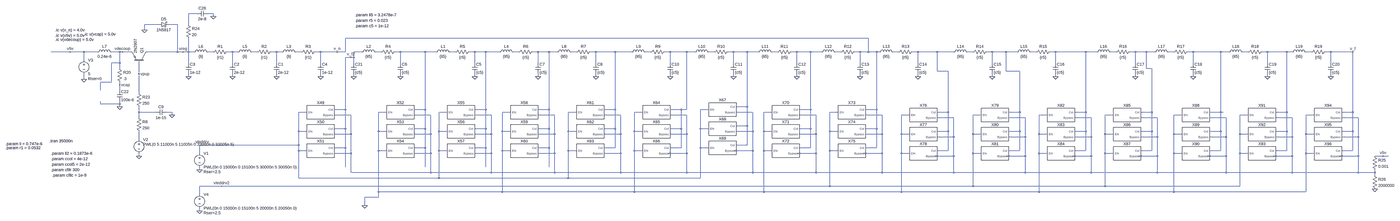
[diagram p0: schematic ModelAccurateColumn2.asc, whole sheet]
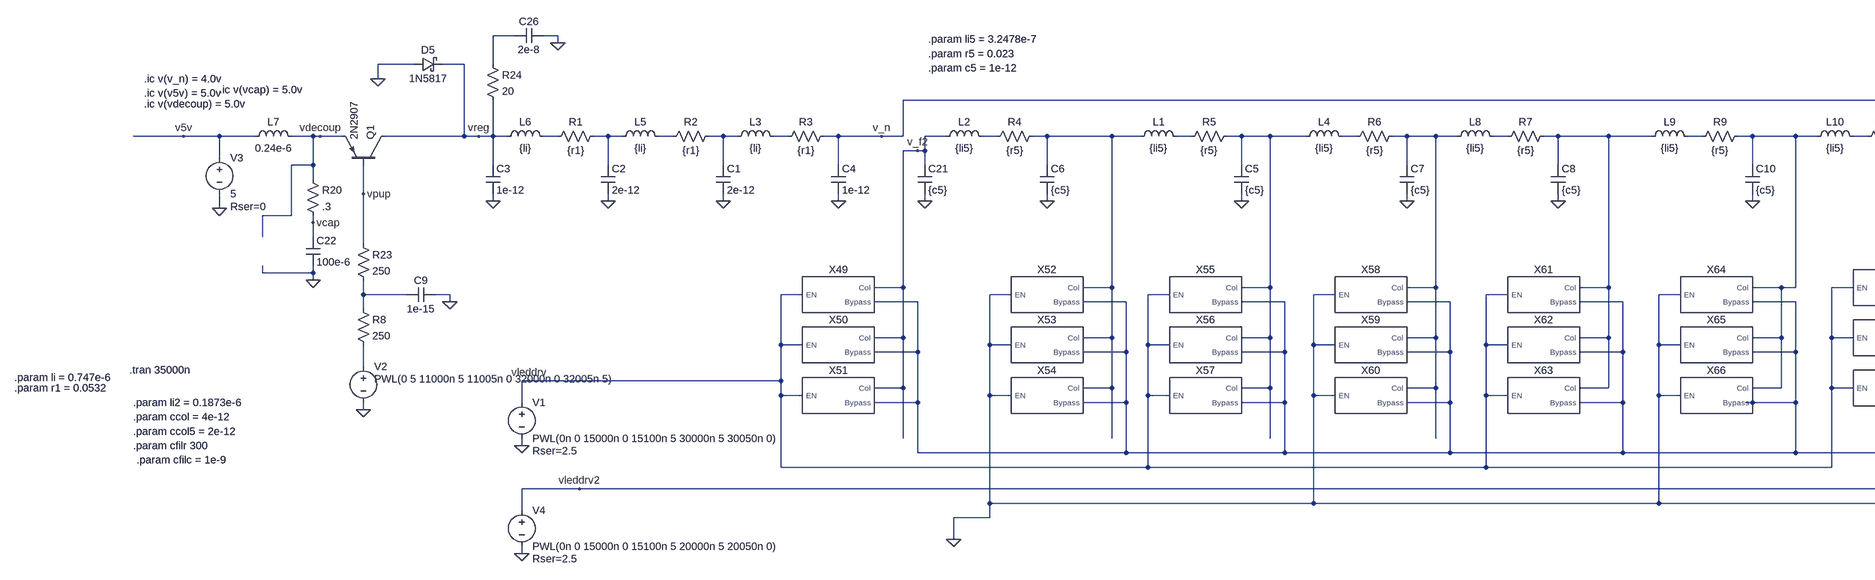
[diagram p1: schematic ModelAccurateColumn2.asc, part, row 1 of 1, column 1 of 2]
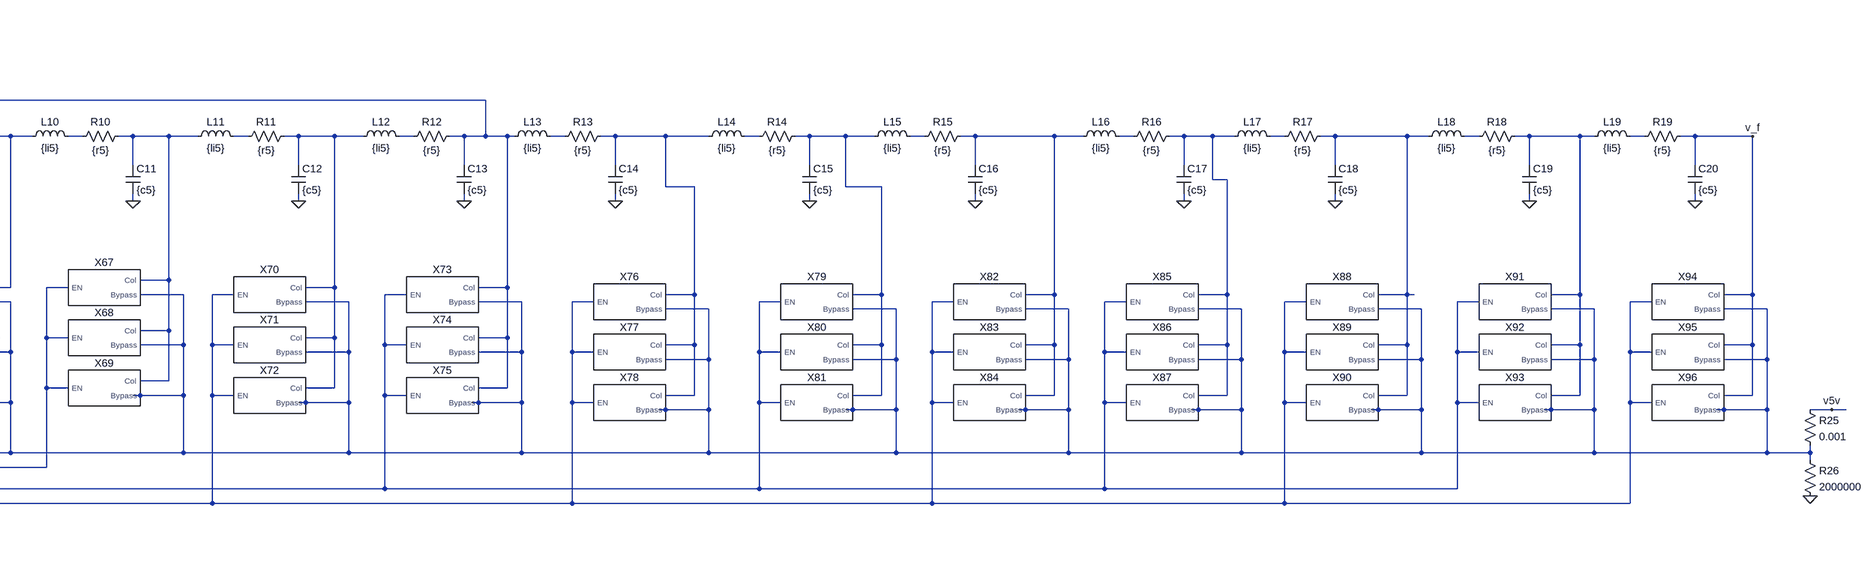
[diagram p2: schematic ModelAccurateColumn2.asc, part, row 1 of 1, column 2 of 2]
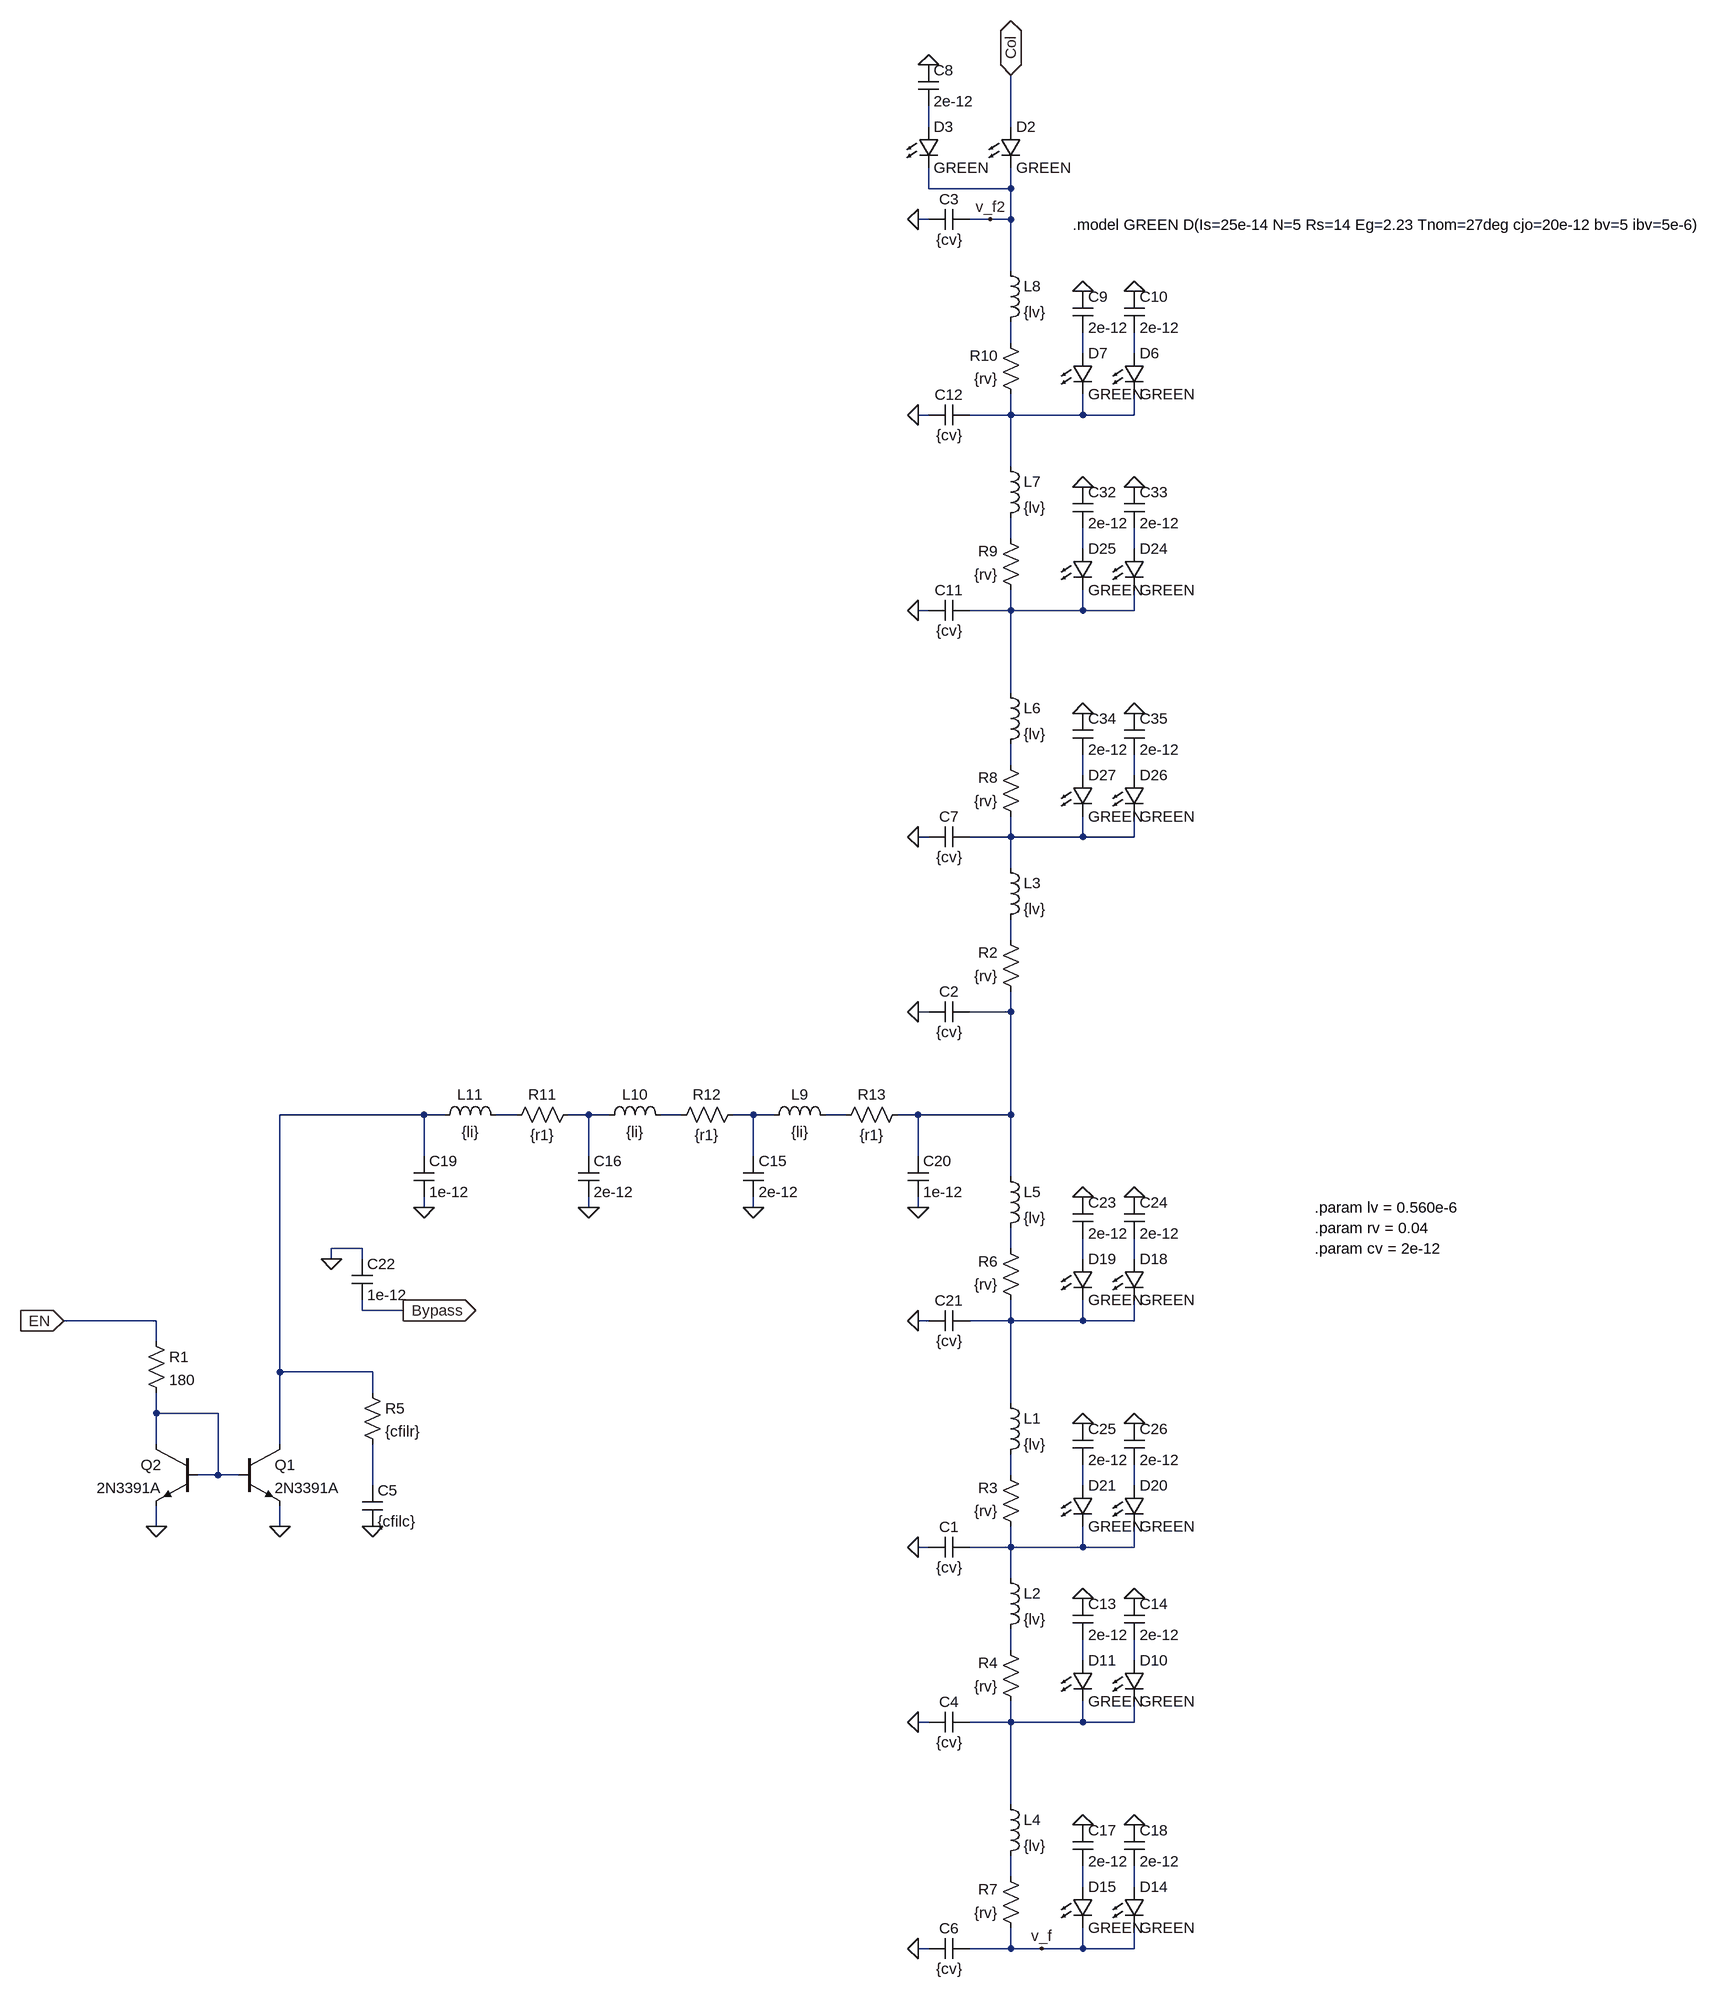
[diagram p3: sub-circuit coldrv2.asc]
ModelAccurateColumn2.asc, the LTspice schematic file:
Version 4
SHEET 1 7096 2164
WIRE 16 -112 -32 -112
WIRE 112 -112 80 -112
WIRE 112 -96 112 -112
WIRE -208 -48 -288 -48
WIRE -96 -48 -144 -48
WIRE -32 -48 -32 -112
WIRE -288 -16 -288 -48
WIRE 3920 32 880 32
WIRE -720 112 -832 112
WIRE -640 112 -720 112
WIRE -560 112 -640 112
WIRE -432 112 -480 112
WIRE -416 112 -432 112
WIRE -368 112 -416 112
WIRE -96 112 -96 -48
WIRE -96 112 -272 112
WIRE -64 112 -96 112
WIRE -32 112 -32 32
WIRE -32 112 -64 112
WIRE 0 112 -32 112
WIRE 112 112 80 112
WIRE 224 112 192 112
WIRE 256 112 224 112
WIRE 368 112 336 112
WIRE 480 112 448 112
WIRE 512 112 480 112
WIRE 624 112 592 112
WIRE 736 112 704 112
WIRE 832 112 736 112
WIRE 880 112 880 32
WIRE 880 112 832 112
WIRE 976 112 928 112
WIRE 1088 112 1056 112
WIRE 1200 112 1168 112
WIRE 1344 112 1200 112
WIRE 1408 112 1344 112
WIRE 1520 112 1488 112
WIRE 1632 112 1600 112
WIRE 1696 112 1632 112
WIRE 1776 112 1696 112
WIRE 1888 112 1856 112
WIRE 2000 112 1968 112
WIRE 2064 112 2000 112
WIRE 2112 112 2064 112
WIRE 2224 112 2192 112
WIRE 2336 112 2304 112
WIRE 2448 112 2336 112
WIRE 2544 112 2448 112
WIRE 2656 112 2624 112
WIRE 2768 112 2736 112
WIRE 2864 112 2768 112
WIRE 2912 112 2864 112
WIRE 3024 112 2992 112
WIRE 3136 112 3104 112
WIRE 3216 112 3136 112
WIRE 3280 112 3216 112
WIRE 3392 112 3360 112
WIRE 3504 112 3472 112
WIRE 3584 112 3504 112
WIRE 3648 112 3584 112
WIRE 3760 112 3728 112
WIRE 3872 112 3840 112
WIRE 3920 112 3920 32
WIRE 3920 112 3872 112
WIRE 3968 112 3920 112
WIRE 3984 112 3968 112
WIRE 4096 112 4064 112
WIRE 4208 112 4176 112
WIRE 4320 112 4208 112
WIRE 4416 112 4320 112
WIRE 4528 112 4496 112
WIRE 4640 112 4608 112
WIRE 4720 112 4640 112
WIRE 4784 112 4720 112
WIRE 4896 112 4864 112
WIRE 5008 112 4976 112
WIRE 5184 112 5008 112
WIRE 5248 112 5184 112
WIRE 5360 112 5328 112
WIRE 5472 112 5440 112
WIRE 5536 112 5472 112
WIRE 5584 112 5536 112
WIRE 5696 112 5664 112
WIRE 5808 112 5776 112
WIRE 5968 112 5808 112
WIRE 6016 112 5968 112
WIRE 6128 112 6096 112
WIRE 6240 112 6208 112
WIRE 6352 112 6240 112
WIRE 6384 112 6352 112
WIRE 6496 112 6464 112
WIRE 6608 112 6576 112
WIRE 6736 112 6608 112
WIRE 912 144 880 144
WIRE 928 144 928 112
WIRE 928 144 912 144
WIRE -640 160 -640 112
WIRE -432 176 -432 112
WIRE -432 176 -480 176
WIRE -32 176 -32 112
WIRE 224 176 224 112
WIRE 480 176 480 112
WIRE 736 176 736 112
WIRE 928 176 928 144
WIRE 1200 176 1200 112
WIRE 1632 176 1632 112
WIRE 2000 176 2000 112
WIRE 2336 176 2336 112
WIRE 2768 176 2768 112
WIRE 3136 176 3136 112
WIRE 3504 176 3504 112
WIRE 3872 176 3872 112
WIRE 4208 176 4208 112
WIRE 4640 176 4640 112
WIRE 5008 176 5008 112
WIRE 5472 176 5472 112
WIRE 5808 176 5808 112
WIRE 6240 176 6240 112
WIRE 6608 176 6608 112
WIRE -432 208 -432 176
WIRE 5536 208 5536 112
WIRE 5568 208 5536 208
WIRE 4320 224 4320 112
WIRE 4384 224 4320 224
WIRE 4720 224 4720 112
WIRE 4800 224 4720 224
WIRE -320 240 -320 176
WIRE -32 256 -32 240
WIRE 224 256 224 240
WIRE 480 256 480 240
WIRE 736 256 736 240
WIRE 928 256 928 240
WIRE 1200 256 1200 240
WIRE 1632 256 1632 240
WIRE 2000 256 2000 240
WIRE 2336 256 2336 240
WIRE 2768 256 2768 240
WIRE 3136 256 3136 240
WIRE 3504 256 3504 240
WIRE 3872 256 3872 240
WIRE 4208 256 4208 240
WIRE 4640 256 4640 240
WIRE 5008 256 5008 240
WIRE 5472 256 5472 240
WIRE 5808 256 5808 240
WIRE 6240 256 6240 240
WIRE 6608 256 6608 240
WIRE -640 272 -640 240
WIRE -480 288 -480 176
WIRE -480 288 -544 288
WIRE -432 304 -432 288
WIRE -544 336 -544 288
WIRE -432 336 -432 304
WIRE -320 352 -320 240
WIRE -544 416 -544 400
WIRE -432 416 -432 400
WIRE -432 416 -544 416
WIRE -432 432 -432 416
WIRE 3216 432 3216 112
WIRE 3216 432 3152 432
WIRE 880 448 880 144
WIRE 880 448 816 448
WIRE 1344 448 1344 112
WIRE 1344 448 1280 448
WIRE 1696 448 1696 112
WIRE 1696 448 1632 448
WIRE 2064 448 2064 112
WIRE 2064 448 2000 448
WIRE 2448 448 2448 112
WIRE 2448 448 2384 448
WIRE 2832 448 2768 448
WIRE 2864 448 2864 112
WIRE 2864 448 2832 448
WIRE 2992 448 2944 448
WIRE 3584 448 3584 112
WIRE 3584 448 3520 448
WIRE 3968 448 3968 112
WIRE 3968 448 3904 448
WIRE -320 464 -320 432
WIRE -224 464 -320 464
WIRE -128 464 -160 464
WIRE 656 464 608 464
WIRE 1120 464 1072 464
WIRE 1472 464 1424 464
WIRE 1840 464 1792 464
WIRE 2224 464 2176 464
WIRE 2608 464 2560 464
WIRE 3248 464 3152 464
WIRE 3360 464 3312 464
WIRE 3744 464 3696 464
WIRE 4384 464 4384 224
WIRE 4384 464 4320 464
WIRE 4800 464 4800 224
WIRE 4800 464 4736 464
WIRE 5184 464 5184 112
WIRE 5184 464 5120 464
WIRE 5568 464 5568 208
WIRE 5568 464 5504 464
WIRE 5968 464 5968 112
WIRE 5968 464 5904 464
WIRE 5984 464 5968 464
WIRE 6352 464 6352 112
WIRE 6352 464 6288 464
WIRE 6736 464 6736 112
WIRE 6736 464 6672 464
WIRE -128 480 -128 464
WIRE 912 480 816 480
WIRE 1376 480 1280 480
WIRE 1728 480 1632 480
WIRE 2096 480 2000 480
WIRE 2480 480 2384 480
WIRE 2864 480 2768 480
WIRE 3616 480 3520 480
WIRE 4000 480 3904 480
WIRE 4160 480 4112 480
WIRE 4576 480 4528 480
WIRE 4960 480 4912 480
WIRE 5344 480 5296 480
WIRE 5744 480 5696 480
WIRE 6128 480 6080 480
WIRE 6512 480 6464 480
WIRE -320 496 -320 464
WIRE 4416 496 4320 496
WIRE 4832 496 4736 496
WIRE 5216 496 5120 496
WIRE 5600 496 5504 496
WIRE 6000 496 5904 496
WIRE 6384 496 6288 496
WIRE 6768 496 6672 496
WIRE 3216 544 3216 432
WIRE 3216 544 3152 544
WIRE 880 560 880 448
WIRE 880 560 816 560
WIRE 1344 560 1344 448
WIRE 1344 560 1280 560
WIRE 1696 560 1696 448
WIRE 1696 560 1632 560
WIRE 2064 560 2064 448
WIRE 2064 560 2000 560
WIRE 2448 560 2448 448
WIRE 2448 560 2384 560
WIRE 2832 560 2832 448
WIRE 2832 560 2768 560
WIRE 2944 560 2944 448
WIRE 2992 560 2944 560
WIRE 3584 560 3584 448
WIRE 3584 560 3520 560
WIRE 3968 560 3968 448
WIRE 3968 560 3904 560
WIRE 608 576 608 464
WIRE 656 576 608 576
WIRE 1072 576 1072 464
WIRE 1120 576 1072 576
WIRE 1424 576 1424 464
WIRE 1472 576 1424 576
WIRE 1792 576 1792 464
WIRE 1840 576 1792 576
WIRE 2176 576 2176 464
WIRE 2224 576 2176 576
WIRE 2560 576 2560 464
WIRE 2608 576 2560 576
WIRE 3248 576 3248 464
WIRE 3248 576 3152 576
WIRE 3312 576 3312 464
WIRE 3360 576 3312 576
WIRE 3696 576 3696 464
WIRE 3744 576 3696 576
WIRE 4384 576 4384 464
WIRE 4384 576 4320 576
WIRE 4800 576 4800 464
WIRE 4800 576 4736 576
WIRE 5184 576 5184 464
WIRE 5184 576 5120 576
WIRE 5568 576 5568 464
WIRE 5568 576 5504 576
WIRE 5968 576 5968 464
WIRE 5968 576 5904 576
WIRE 6352 576 6352 464
WIRE 6352 576 6288 576
WIRE 6736 576 6736 464
WIRE 6736 576 6672 576
WIRE 912 592 912 480
WIRE 912 592 816 592
WIRE 1376 592 1376 480
WIRE 1376 592 1280 592
WIRE 1728 592 1728 480
WIRE 1728 592 1632 592
WIRE 2096 592 2096 480
WIRE 2096 592 2000 592
WIRE 2480 592 2480 480
WIRE 2480 592 2384 592
WIRE 2864 592 2864 480
WIRE 2864 592 2768 592
WIRE 3616 592 3616 480
WIRE 3616 592 3520 592
WIRE 4000 592 4000 480
WIRE 4000 592 3904 592
WIRE 4112 592 4112 480
WIRE 4160 592 4112 592
WIRE 4528 592 4528 480
WIRE 4576 592 4528 592
WIRE 4912 592 4912 480
WIRE 4960 592 4912 592
WIRE 5296 592 5296 480
WIRE 5344 592 5296 592
WIRE 5696 592 5696 480
WIRE 5744 592 5696 592
WIRE 6080 592 6080 480
WIRE 6128 592 6080 592
WIRE 6464 592 6464 480
WIRE 6512 592 6464 592
WIRE 4416 608 4416 496
WIRE 4416 608 4320 608
WIRE 4832 608 4832 496
WIRE 4832 608 4736 608
WIRE 5216 608 5216 496
WIRE 5216 608 5120 608
WIRE 5600 608 5600 496
WIRE 5600 608 5504 608
WIRE 6000 608 6000 496
WIRE 6000 608 5904 608
WIRE 6384 608 6384 496
WIRE 6384 608 6288 608
WIRE 6768 608 6768 496
WIRE 6768 608 6672 608
WIRE -320 624 -320 576
WIRE 48 656 32 656
WIRE 608 656 608 576
WIRE 608 656 48 656
WIRE 3216 656 3216 544
WIRE 3216 656 3152 656
WIRE 880 672 880 560
WIRE 880 672 816 672
WIRE 1344 672 1344 560
WIRE 1344 672 1280 672
WIRE 1696 672 1696 560
WIRE 1696 672 1632 672
WIRE 2064 672 2064 560
WIRE 2064 672 2000 672
WIRE 2448 672 2448 560
WIRE 2448 672 2384 672
WIRE 2832 672 2832 560
WIRE 2832 672 2768 672
WIRE 2944 672 2944 560
WIRE 2992 672 2944 672
WIRE 3584 672 3584 560
WIRE 3584 672 3520 672
WIRE 3968 672 3968 560
WIRE 3968 672 3904 672
WIRE 608 688 608 656
WIRE 656 688 608 688
WIRE 1072 688 1072 576
WIRE 1120 688 1072 688
WIRE 1424 688 1424 576
WIRE 1472 688 1424 688
WIRE 1792 688 1792 576
WIRE 1840 688 1792 688
WIRE 2176 688 2176 576
WIRE 2224 688 2176 688
WIRE 2560 688 2560 576
WIRE 2608 688 2560 688
WIRE 3152 688 3136 688
WIRE 3248 688 3248 576
WIRE 3248 688 3152 688
WIRE 3312 688 3312 576
WIRE 3360 688 3312 688
WIRE 3696 688 3696 576
WIRE 3744 688 3696 688
WIRE 4384 688 4384 576
WIRE 4384 688 4320 688
WIRE 4800 688 4800 576
WIRE 4800 688 4736 688
WIRE 5184 688 5184 576
WIRE 5184 688 5120 688
WIRE 5568 688 5568 576
WIRE 5568 688 5504 688
WIRE 5968 688 5968 576
WIRE 5968 688 5904 688
WIRE 6352 688 6352 576
WIRE 6352 688 6288 688
WIRE 6736 688 6736 576
WIRE 6736 688 6672 688
WIRE 32 704 32 656
WIRE 912 704 912 592
WIRE 912 704 816 704
WIRE 1376 704 1376 592
WIRE 1376 704 1280 704
WIRE 1728 704 1728 592
WIRE 1728 704 1632 704
WIRE 2096 704 2096 592
WIRE 2096 704 2000 704
WIRE 2480 704 2480 592
WIRE 2480 704 2384 704
WIRE 2768 704 2752 704
WIRE 2864 704 2864 592
WIRE 2864 704 2768 704
WIRE 3520 704 3504 704
WIRE 3616 704 3616 592
WIRE 3616 704 3520 704
WIRE 3904 704 3888 704
WIRE 4000 704 4000 592
WIRE 4000 704 3904 704
WIRE 4112 704 4112 592
WIRE 4160 704 4112 704
WIRE 4528 704 4528 592
WIRE 4576 704 4528 704
WIRE 4912 704 4912 592
WIRE 4960 704 4912 704
WIRE 5296 704 5296 592
WIRE 5344 704 5296 704
WIRE 5696 704 5696 592
WIRE 5744 704 5696 704
WIRE 6080 704 6080 592
WIRE 6128 704 6080 704
WIRE 6464 704 6464 592
WIRE 6512 704 6464 704
WIRE -320 720 -320 704
WIRE 4320 720 4304 720
WIRE 4416 720 4416 608
WIRE 4416 720 4320 720
WIRE 4736 720 4720 720
WIRE 4832 720 4832 608
WIRE 4832 720 4736 720
WIRE 5120 720 5104 720
WIRE 5216 720 5216 608
WIRE 5216 720 5120 720
WIRE 5504 720 5488 720
WIRE 5600 720 5600 608
WIRE 5600 720 5504 720
WIRE 5904 720 5888 720
WIRE 6000 720 6000 608
WIRE 6000 720 5904 720
WIRE 6288 720 6272 720
WIRE 6384 720 6384 608
WIRE 6384 720 6288 720
WIRE 6672 720 6656 720
WIRE 6768 720 6768 608
WIRE 6768 720 6672 720
WIRE 6912 720 6864 720
WIRE 6944 720 6912 720
WIRE 880 784 880 672
WIRE 1344 784 1344 672
WIRE 1696 784 1696 672
WIRE 2064 784 2064 672
WIRE 32 800 32 784
WIRE 912 816 912 704
WIRE 1376 816 1376 704
WIRE 1376 816 912 816
WIRE 1728 816 1728 704
WIRE 1728 816 1376 816
WIRE 2096 816 2096 704
WIRE 2096 816 1728 816
WIRE 2480 816 2480 704
WIRE 2480 816 2096 816
WIRE 2864 816 2864 704
WIRE 2864 816 2480 816
WIRE 3248 816 3248 688
WIRE 3248 816 2864 816
WIRE 3616 816 3616 704
WIRE 3616 816 3248 816
WIRE 4000 816 4000 704
WIRE 4000 816 3616 816
WIRE 4416 816 4416 720
WIRE 4416 816 4000 816
WIRE 4832 816 4832 720
WIRE 4832 816 4416 816
WIRE 5216 816 5216 720
WIRE 5216 816 4832 816
WIRE 5600 816 5600 720
WIRE 5600 816 5216 816
WIRE 6000 816 6000 720
WIRE 6000 816 5600 816
WIRE 6384 816 6384 720
WIRE 6384 816 6000 816
WIRE 6768 816 6768 720
WIRE 6768 816 6384 816
WIRE 6864 816 6864 800
WIRE 6864 816 6768 816
WIRE 6864 832 6864 816
WIRE 608 848 608 688
WIRE 1424 848 1424 688
WIRE 1424 848 608 848
WIRE 2176 848 2176 688
WIRE 2176 848 1424 848
WIRE 2944 848 2944 672
WIRE 2944 848 2176 848
WIRE 160 896 32 896
WIRE 3696 896 3696 688
WIRE 3696 896 160 896
WIRE 4528 896 4528 704
WIRE 4528 896 3696 896
WIRE 5296 896 5296 704
WIRE 5296 896 4528 896
WIRE 6080 896 6080 704
WIRE 6080 896 5296 896
WIRE 1072 928 1072 688
WIRE 1792 928 1792 688
WIRE 1792 928 1072 928
WIRE 2560 928 2560 688
WIRE 2560 928 1792 928
WIRE 3312 928 3312 688
WIRE 3312 928 2560 928
WIRE 4112 928 4112 704
WIRE 4112 928 3312 928
WIRE 4912 928 4912 704
WIRE 4912 928 4112 928
WIRE 5696 928 5696 704
WIRE 5696 928 4912 928
WIRE 6464 928 6464 704
WIRE 6464 928 5696 928
WIRE 32 944 32 896
WIRE 1072 960 1072 928
WIRE 1072 960 992 960
WIRE 992 1008 992 960
WIRE 32 1040 32 1024
FLAG -32 256 0
FLAG 224 256 0
FLAG 480 256 0
FLAG 736 256 0
FLAG 1200 256 0
FLAG -640 272 0
FLAG -320 720 0
FLAG 32 800 0
FLAG 832 112 v_n
FLAG -288 -16 0
FLAG -64 112 vreg
FLAG -720 112 v5v
FLAG 6912 720 v5v
FLAG -320 240 vpup
FLAG 48 656 vleddrv
FLAG 32 1040 0
FLAG 112 -96 0
FLAG 6864 912 0
FLAG 160 896 vleddrv2
FLAG -128 480 0
FLAG 992 1008 0
FLAG 1632 256 0
FLAG 2000 256 0
FLAG 2336 256 0
FLAG 2768 256 0
FLAG 3136 256 0
FLAG 3504 256 0
FLAG 3872 256 0
FLAG 4208 256 0
FLAG 4640 256 0
FLAG 5008 256 0
FLAG 5472 256 0
FLAG 5808 256 0
FLAG 6240 256 0
FLAG 6608 256 0
FLAG 6736 112 v_f
FLAG 928 256 0
FLAG 912 144 v_f2
FLAG -432 432 0
FLAG -416 112 vdecoup
FLAG -432 304 vcap
SYMBOL pnp -272 176 M270
SYMATTR InstName Q1
SYMATTR Value 2N2907
SYMBOL res 208 96 R90
WINDOW 0 0 56 VBottom 0
WINDOW 3 32 56 VTop 0
SYMATTR InstName R1
SYMATTR Value {r1}
SYMBOL res 464 96 R90
WINDOW 0 0 56 VBottom 0
WINDOW 3 32 56 VTop 0
SYMATTR InstName R2
SYMATTR Value {r1}
SYMBOL res 720 96 R90
WINDOW 0 0 56 VBottom 0
WINDOW 3 32 56 VTop 0
SYMATTR InstName R3
SYMATTR Value {r1}
SYMBOL cap 464 176 R0
SYMATTR InstName C1
SYMATTR Value 2e-12
SYMBOL cap 208 176 R0
SYMATTR InstName C2
SYMATTR Value 2e-12
SYMBOL cap -48 176 R0
SYMATTR InstName C3
SYMATTR Value 1e-12
SYMBOL cap 720 176 R0
SYMATTR InstName C4
SYMATTR Value 1e-12
SYMBOL res 1184 96 R90
WINDOW 0 0 56 VBottom 0
WINDOW 3 32 56 VTop 0
SYMATTR InstName R4
SYMATTR Value {r5}
SYMBOL cap 1184 176 R0
SYMATTR InstName C6
SYMATTR Value {c5}
SYMBOL voltage 32 688 R0
WINDOW 123 0 0 Left 0
WINDOW 39 24 124 Left 0
SYMATTR SpiceLine Rser=2.5
SYMATTR InstName V1
SYMATTR Value PWL(0n 0 15000n 0 15100n 5 30000n 5 30050n 0)
SYMBOL voltage -320 608 R0
WINDOW 3 24 44 Left 0
WINDOW 123 0 0 Left 0
WINDOW 39 0 0 Left 0
SYMATTR Value PWL(0 5 11000n 5 11005n 0 32000n 0 32005n 5)
SYMATTR InstName V2
SYMBOL voltage -640 144 R0
WINDOW 123 0 0 Left 0
WINDOW 39 24 124 Left 0
SYMATTR SpiceLine Rser=0
SYMATTR InstName V3
SYMATTR Value 5
SYMBOL ind 960 128 R270
WINDOW 0 32 56 VTop 0
WINDOW 3 5 56 VBottom 0
SYMATTR InstName L2
SYMATTR Value {li5}
SYMBOL ind 496 128 R270
WINDOW 0 32 56 VTop 0
WINDOW 3 5 56 VBottom 0
SYMATTR InstName L3
SYMATTR Value {li}
SYMBOL ind 240 128 R270
WINDOW 0 32 56 VTop 0
WINDOW 3 5 56 VBottom 0
SYMATTR InstName L5
SYMATTR Value {li}
SYMBOL ind -16 128 R270
WINDOW 0 32 56 VTop 0
WINDOW 3 5 56 VBottom 0
SYMATTR InstName L6
SYMATTR Value {li}
SYMBOL schottky -208 -32 R270
WINDOW 0 32 32 VTop 0
WINDOW 3 0 32 VBottom 0
SYMATTR InstName D5
SYMATTR Value 1N5817
SYMATTR Description Diode
SYMATTR Type diode
SYMBOL res -336 336 R0
SYMATTR InstName R23
SYMATTR Value 250
SYMBOL voltage 32 928 R0
WINDOW 123 0 0 Left 0
WINDOW 39 24 124 Left 0
SYMATTR SpiceLine Rser=2.5
SYMATTR InstName V4
SYMATTR Value PWL(0n 0 15000n 0 15100n 5 20000n 5 20050n 0)
SYMBOL res -48 -64 R0
SYMATTR InstName R24
SYMATTR Value 20
SYMBOL cap 80 -128 R90
WINDOW 0 0 32 VBottom 0
WINDOW 3 32 32 VTop 0
SYMATTR InstName C26
SYMATTR Value 2e-8
SYMBOL res 6848 704 R0
SYMATTR InstName R25
SYMATTR Value 0.001
SYMBOL res 6848 816 R0
SYMATTR InstName R26
SYMATTR Value 2000000
SYMBOL cap -160 448 R90
WINDOW 0 0 32 VBottom 0
WINDOW 3 32 32 VTop 0
SYMATTR InstName C9
SYMATTR Value 1e-15
SYMBOL res -336 480 R0
SYMATTR InstName R8
SYMATTR Value 250
SYMBOL ind -576 128 R270
WINDOW 0 32 56 VTop 0
WINDOW 3 5 56 VBottom 0
SYMATTR InstName L7
SYMATTR Value 0.24e-6
SYMBOL res 1616 96 R90
WINDOW 0 0 56 VBottom 0
WINDOW 3 32 56 VTop 0
SYMATTR InstName R5
SYMATTR Value {r5}
SYMBOL cap 1616 176 R0
SYMATTR InstName C5
SYMATTR Value {c5}
SYMBOL ind 1392 128 R270
WINDOW 0 32 56 VTop 0
WINDOW 3 5 56 VBottom 0
SYMATTR InstName L1
SYMATTR Value {li5}
SYMBOL res 1984 96 R90
WINDOW 0 0 56 VBottom 0
WINDOW 3 32 56 VTop 0
SYMATTR InstName R6
SYMATTR Value {r5}
SYMBOL cap 1984 176 R0
SYMATTR InstName C7
SYMATTR Value {c5}
SYMBOL ind 1760 128 R270
WINDOW 0 32 56 VTop 0
WINDOW 3 5 56 VBottom 0
SYMATTR InstName L4
SYMATTR Value {li5}
SYMBOL res 2320 96 R90
WINDOW 0 0 56 VBottom 0
WINDOW 3 32 56 VTop 0
SYMATTR InstName R7
SYMATTR Value {r5}
SYMBOL cap 2320 176 R0
SYMATTR InstName C8
SYMATTR Value {c5}
SYMBOL ind 2096 128 R270
WINDOW 0 32 56 VTop 0
WINDOW 3 5 56 VBottom 0
SYMATTR InstName L8
SYMATTR Value {li5}
SYMBOL res 2752 96 R90
WINDOW 0 0 56 VBottom 0
WINDOW 3 32 56 VTop 0
SYMATTR InstName R9
SYMATTR Value {r5}
SYMBOL cap 2752 176 R0
SYMATTR InstName C10
SYMATTR Value {c5}
SYMBOL ind 2528 128 R270
WINDOW 0 32 56 VTop 0
WINDOW 3 5 56 VBottom 0
SYMATTR InstName L9
SYMATTR Value {li5}
SYMBOL res 3120 96 R90
WINDOW 0 0 56 VBottom 0
WINDOW 3 32 56 VTop 0
SYMATTR InstName R10
SYMATTR Value {r5}
SYMBOL cap 3120 176 R0
SYMATTR InstName C11
SYMATTR Value {c5}
SYMBOL ind 2896 128 R270
WINDOW 0 32 56 VTop 0
WINDOW 3 5 56 VBottom 0
SYMATTR InstName L10
SYMATTR Value {li5}
SYMBOL res 3488 96 R90
WINDOW 0 0 56 VBottom 0
WINDOW 3 32 56 VTop 0
SYMATTR InstName R11
SYMATTR Value {r5}
SYMBOL cap 3488 176 R0
SYMATTR InstName C12
SYMATTR Value {c5}
SYMBOL ind 3264 128 R270
WINDOW 0 32 56 VTop 0
WINDOW 3 5 56 VBottom 0
SYMATTR InstName L11
SYMATTR Value {li5}
SYMBOL res 3856 96 R90
WINDOW 0 0 56 VBottom 0
WINDOW 3 32 56 VTop 0
SYMATTR InstName R12
SYMATTR Value {r5}
SYMBOL cap 3856 176 R0
SYMATTR InstName C13
SYMATTR Value {c5}
SYMBOL ind 3632 128 R270
WINDOW 0 32 56 VTop 0
WINDOW 3 5 56 VBottom 0
SYMATTR InstName L12
SYMATTR Value {li5}
SYMBOL res 4192 96 R90
WINDOW 0 0 56 VBottom 0
WINDOW 3 32 56 VTop 0
SYMATTR InstName R13
SYMATTR Value {r5}
SYMBOL cap 4192 176 R0
SYMATTR InstName C14
SYMATTR Value {c5}
SYMBOL ind 3968 128 R270
WINDOW 0 32 56 VTop 0
WINDOW 3 5 56 VBottom 0
SYMATTR InstName L13
SYMATTR Value {li5}
SYMBOL res 4624 96 R90
WINDOW 0 0 56 VBottom 0
WINDOW 3 32 56 VTop 0
SYMATTR InstName R14
SYMATTR Value {r5}
SYMBOL cap 4624 176 R0
SYMATTR InstName C15
SYMATTR Value {c5}
SYMBOL ind 4400 128 R270
WINDOW 0 32 56 VTop 0
WINDOW 3 5 56 VBottom 0
SYMATTR InstName L14
SYMATTR Value {li5}
SYMBOL res 4992 96 R90
WINDOW 0 0 56 VBottom 0
WINDOW 3 32 56 VTop 0
SYMATTR InstName R15
SYMATTR Value {r5}
SYMBOL cap 4992 176 R0
SYMATTR InstName C16
SYMATTR Value {c5}
SYMBOL ind 4768 128 R270
WINDOW 0 32 56 VTop 0
WINDOW 3 5 56 VBottom 0
SYMATTR InstName L15
SYMATTR Value {li5}
SYMBOL res 5456 96 R90
WINDOW 0 0 56 VBottom 0
WINDOW 3 32 56 VTop 0
SYMATTR InstName R16
SYMATTR Value {r5}
SYMBOL cap 5456 176 R0
SYMATTR InstName C17
SYMATTR Value {c5}
SYMBOL ind 5232 128 R270
WINDOW 0 32 56 VTop 0
WINDOW 3 5 56 VBottom 0
SYMATTR InstName L16
SYMATTR Value {li5}
SYMBOL res 5792 96 R90
WINDOW 0 0 56 VBottom 0
WINDOW 3 32 56 VTop 0
SYMATTR InstName R17
SYMATTR Value {r5}
SYMBOL cap 5792 176 R0
SYMATTR InstName C18
SYMATTR Value {c5}
SYMBOL ind 5568 128 R270
WINDOW 0 32 56 VTop 0
WINDOW 3 5 56 VBottom 0
SYMATTR InstName L17
SYMATTR Value {li5}
SYMBOL res 6224 96 R90
WINDOW 0 0 56 VBottom 0
WINDOW 3 32 56 VTop 0
SYMATTR InstName R18
SYMATTR Value {r5}
SYMBOL cap 6224 176 R0
SYMATTR InstName C19
SYMATTR Value {c5}
SYMBOL ind 6000 128 R270
WINDOW 0 32 56 VTop 0
WINDOW 3 5 56 VBottom 0
SYMATTR InstName L18
SYMATTR Value {li5}
SYMBOL res 6592 96 R90
WINDOW 0 0 56 VBottom 0
WINDOW 3 32 56 VTop 0
SYMATTR InstName R19
SYMATTR Value {r5}
SYMBOL cap 6592 176 R0
SYMATTR InstName C20
SYMATTR Value {c5}
SYMBOL ind 6368 128 R270
WINDOW 0 32 56 VTop 0
WINDOW 3 5 56 VBottom 0
SYMATTR InstName L19
SYMATTR Value {li5}
SYMBOL cap 912 176 R0
SYMATTR InstName C21
SYMATTR Value {c5}
SYMBOL ColDrv2 736 464 R0
SYMATTR InstName X49
SYMBOL ColDrv2 736 576 R0
SYMATTR InstName X50
SYMBOL ColDrv2 736 688 R0
SYMATTR InstName X51
SYMBOL ColDrv2 1200 464 R0
SYMATTR InstName X52
SYMBOL ColDrv2 1200 576 R0
SYMATTR InstName X53
SYMBOL ColDrv2 1200 688 R0
SYMATTR InstName X54
SYMBOL ColDrv2 1552 464 R0
SYMATTR InstName X55
SYMBOL ColDrv2 1552 576 R0
SYMATTR InstName X56
SYMBOL ColDrv2 1552 688 R0
SYMATTR InstName X57
SYMBOL ColDrv2 1920 464 R0
SYMATTR InstName X58
SYMBOL ColDrv2 1920 576 R0
SYMATTR InstName X59
SYMBOL ColDrv2 1920 688 R0
SYMATTR InstName X60
SYMBOL ColDrv2 2304 464 R0
SYMATTR InstName X61
SYMBOL ColDrv2 2304 576 R0
SYMATTR InstName X62
SYMBOL ColDrv2 2304 688 R0
SYMATTR InstName X63
SYMBOL ColDrv2 2688 464 R0
SYMATTR InstName X64
SYMBOL ColDrv2 2688 576 R0
SYMATTR InstName X65
SYMBOL ColDrv2 2688 688 R0
SYMATTR InstName X66
SYMBOL ColDrv2 3072 448 R0
SYMATTR InstName X67
SYMBOL ColDrv2 3072 560 R0
SYMATTR InstName X68
SYMBOL ColDrv2 3072 672 R0
SYMATTR InstName X69
SYMBOL ColDrv2 3440 464 R0
SYMATTR InstName X70
SYMBOL ColDrv2 3440 576 R0
SYMATTR InstName X71
SYMBOL ColDrv2 3440 688 R0
SYMATTR InstName X72
SYMBOL ColDrv2 3824 464 R0
SYMATTR InstName X73
SYMBOL ColDrv2 3824 576 R0
SYMATTR InstName X74
SYMBOL ColDrv2 3824 688 R0
SYMATTR InstName X75
SYMBOL ColDrv2 4240 480 R0
SYMATTR InstName X76
SYMBOL ColDrv2 4240 592 R0
SYMATTR InstName X77
SYMBOL ColDrv2 4240 704 R0
SYMATTR InstName X78
SYMBOL ColDrv2 4656 480 R0
SYMATTR InstName X79
SYMBOL ColDrv2 4656 592 R0
SYMATTR InstName X80
SYMBOL ColDrv2 4656 704 R0
SYMATTR InstName X81
SYMBOL ColDrv2 5040 480 R0
SYMATTR InstName X82
SYMBOL ColDrv2 5040 592 R0
SYMATTR InstName X83
SYMBOL ColDrv2 5040 704 R0
SYMATTR InstName X84
SYMBOL ColDrv2 5424 480 R0
SYMATTR InstName X85
SYMBOL ColDrv2 5424 592 R0
SYMATTR InstName X86
SYMBOL ColDrv2 5424 704 R0
SYMATTR InstName X87
SYMBOL ColDrv2 5824 480 R0
SYMATTR InstName X88
SYMBOL ColDrv2 5824 592 R0
SYMATTR InstName X89
SYMBOL ColDrv2 5824 704 R0
SYMATTR InstName X90
SYMBOL ColDrv2 6208 480 R0
SYMATTR InstName X91
SYMBOL ColDrv2 6208 592 R0
SYMATTR InstName X92
SYMBOL ColDrv2 6208 704 R0
SYMATTR InstName X93
SYMBOL ColDrv2 6592 480 R0
SYMATTR InstName X94
SYMBOL ColDrv2 6592 592 R0
SYMATTR InstName X95
SYMBOL ColDrv2 6592 704 R0
SYMATTR InstName X96
SYMBOL cap -448 336 R0
SYMATTR InstName C22
SYMATTR Value 100e-6
SYMBOL res -448 192 R0
SYMATTR InstName R20
SYMATTR Value .3
TEXT -840 632 Left 0 !.tran 35000n
TEXT -1096 648 Left 0 !.param li = 0.747e-6
TEXT -832 704 Left 0 !.param li2 = 0.1873e-6
TEXT -832 736 Left 0 !.param ccol = 4e-12
TEXT -832 768 Left 0 !.param ccol5 = 2e-12
TEXT -832 800 Left 0 !.param cfilr 300
TEXT -824 832 Left 0 !.param cfilc = 1e-9
TEXT 936 -104 Left 0 !.param li5 = 3.2478e-7
TEXT 936 -72 Left 0 !.param r5 = 0.023
TEXT 936 -40 Left 0 !.param c5 = 1e-12
TEXT -808 -16 Left 0 !.ic v(v_n) = 4.0v
TEXT -808 16 Left 0 !.ic v(v5v) = 5.0v
TEXT -808 40 Left 0 !.ic v(vdecoup) = 5.0v
TEXT -640 8 Left 0 !.ic v(vcap) = 5.0v
TEXT -1096 672 Left 0 !.param r1 = 0.0532

coldrv2.asc, the sub-circuit schematic file:
Version 4
SHEET 1 1644 1728
WIRE 256 -1152 256 -1184
WIRE 384 -1152 384 -1232
WIRE 256 -1056 256 -1088
WIRE 384 -1056 384 -1088
WIRE 384 -1056 256 -1056
WIRE 256 -1008 240 -1008
WIRE 352 -1008 320 -1008
WIRE 384 -1008 384 -1056
WIRE 384 -1008 352 -1008
WIRE 384 -928 384 -1008
WIRE 384 -816 384 -848
WIRE 496 -800 496 -832
WIRE 576 -800 576 -832
WIRE 256 -704 240 -704
WIRE 384 -704 384 -736
WIRE 384 -704 320 -704
WIRE 496 -704 496 -736
WIRE 496 -704 384 -704
WIRE 576 -704 576 -736
WIRE 576 -704 496 -704
WIRE 384 -624 384 -704
WIRE 384 -512 384 -544
WIRE 496 -496 496 -528
WIRE 576 -496 576 -528
WIRE 256 -400 240 -400
WIRE 384 -400 384 -432
WIRE 384 -400 320 -400
WIRE 496 -400 496 -432
WIRE 496 -400 384 -400
WIRE 576 -400 576 -432
WIRE 576 -400 496 -400
WIRE 384 -272 384 -400
WIRE 384 -160 384 -192
WIRE 496 -144 496 -176
WIRE 576 -144 576 -176
WIRE 256 -48 240 -48
WIRE 384 -48 384 -80
WIRE 384 -48 320 -48
WIRE 496 -48 496 -80
WIRE 496 -48 384 -48
WIRE 576 -48 576 -80
WIRE 576 -48 496 -48
WIRE 384 0 384 -48
WIRE 384 112 384 80
WIRE 256 224 240 224
WIRE 384 224 384 192
WIRE 384 224 320 224
WIRE -528 384 -752 384
WIRE -496 384 -528 384
WIRE -384 384 -416 384
WIRE -272 384 -304 384
WIRE -240 384 -272 384
WIRE -128 384 -160 384
WIRE -16 384 -48 384
WIRE 16 384 -16 384
WIRE 128 384 96 384
WIRE 240 384 208 384
WIRE 384 384 384 224
WIRE 384 384 240 384
WIRE -528 448 -528 384
WIRE -272 448 -272 384
WIRE -16 448 -16 384
WIRE 240 448 240 384
WIRE 384 480 384 384
WIRE -528 528 -528 512
WIRE -272 528 -272 512
WIRE -16 528 -16 512
WIRE 240 528 240 512
WIRE -624 592 -672 592
WIRE 384 592 384 560
WIRE -672 608 -672 592
WIRE -624 608 -624 592
WIRE 496 608 496 576
WIRE 576 608 576 576
WIRE -624 688 -624 672
WIRE -560 688 -624 688
WIRE -944 704 -1088 704
WIRE 256 704 240 704
WIRE 384 704 384 672
WIRE 384 704 320 704
WIRE 496 704 496 672
WIRE 496 704 384 704
WIRE 576 704 576 672
WIRE 576 704 496 704
WIRE -944 736 -944 704
WIRE -752 784 -752 384
WIRE -608 784 -752 784
WIRE -608 816 -608 784
WIRE 384 832 384 704
WIRE -944 848 -944 816
WIRE -848 848 -944 848
WIRE -944 896 -944 848
WIRE -752 896 -752 784
WIRE -848 944 -848 848
WIRE -848 944 -880 944
WIRE -816 944 -848 944
WIRE 384 944 384 912
WIRE -608 960 -608 896
WIRE 496 960 496 928
WIRE 576 960 576 928
WIRE -944 1024 -944 992
WIRE -752 1024 -752 992
WIRE 256 1056 240 1056
WIRE 384 1056 384 1024
WIRE 384 1056 320 1056
WIRE 496 1056 496 1024
WIRE 496 1056 384 1056
WIRE 576 1056 576 1024
WIRE 576 1056 496 1056
WIRE 384 1104 384 1056
WIRE 384 1216 384 1184
WIRE 496 1232 496 1200
WIRE 576 1232 576 1200
WIRE 256 1328 240 1328
WIRE 384 1328 384 1296
WIRE 384 1328 320 1328
WIRE 496 1328 496 1296
WIRE 496 1328 384 1328
WIRE 576 1328 576 1296
WIRE 576 1328 496 1328
WIRE 384 1456 384 1328
WIRE 384 1568 384 1536
WIRE 496 1584 496 1552
WIRE 576 1584 576 1552
WIRE 256 1680 240 1680
WIRE 384 1680 384 1648
WIRE 384 1680 320 1680
WIRE 432 1680 384 1680
WIRE 496 1680 496 1648
WIRE 496 1680 432 1680
WIRE 576 1680 576 1648
WIRE 576 1680 496 1680
FLAG -752 1024 0
FLAG -944 1024 0
FLAG 240 -1008 0
FLAG -1088 704 EN
IOPIN -1088 704 In
FLAG -560 688 Bypass
IOPIN -560 688 Out
FLAG -608 1024 0
FLAG 384 -1232 Col
IOPIN 384 -1232 BiDir
FLAG 256 -1248 0
FLAG 496 -896 0
FLAG 576 -896 0
FLAG 496 1136 0
FLAG 576 1136 0
FLAG 496 1488 0
FLAG 576 1488 0
FLAG 240 704 0
FLAG 496 512 0
FLAG 576 512 0
FLAG 496 864 0
FLAG 576 864 0
FLAG 496 -592 0
FLAG 576 -592 0
FLAG 496 -240 0
FLAG 576 -240 0
FLAG 432 1680 v_f
FLAG 352 -1008 v_f2
FLAG 240 1056 0
FLAG 240 1328 0
FLAG 240 1680 0
FLAG 240 224 0
FLAG 240 -48 0
FLAG 240 -400 0
FLAG 240 -704 0
FLAG -528 528 0
FLAG -272 528 0
FLAG -16 528 0
FLAG 240 528 0
FLAG -672 608 0
SYMBOL npn -816 896 R0
SYMATTR InstName Q1
SYMATTR Value 2N3391A
SYMBOL npn -880 896 M0
SYMATTR InstName Q2
SYMATTR Value 2N3391A
SYMBOL res -960 720 R0
SYMATTR InstName R1
SYMATTR Value 180
SYMBOL cap 320 -1024 R90
WINDOW 0 0 32 VBottom 0
WINDOW 3 32 32 VTop 0
SYMATTR InstName C3
SYMATTR Value {cv}
SYMBOL LED 368 -1152 R0
SYMATTR InstName D2
SYMATTR Value GREEN
SYMATTR Description Diode
SYMATTR Type diode
SYMBOL res -624 800 R0
SYMATTR InstName R5
SYMATTR Value {cfilr}
SYMBOL cap -624 960 R0
SYMATTR InstName C5
SYMATTR Value {cfilc}
SYMBOL LED 240 -1152 R0
SYMATTR InstName D3
SYMATTR Value GREEN
SYMATTR Description Diode
SYMATTR Type diode
SYMBOL cap 240 -1248 R0
SYMATTR InstName C8
SYMATTR Value 2e-12
SYMBOL LED 560 -800 R0
SYMATTR InstName D6
SYMATTR Value GREEN
SYMATTR Description Diode
SYMATTR Type diode
SYMBOL LED 480 -800 R0
SYMATTR InstName D7
SYMATTR Value GREEN
SYMATTR Description Diode
SYMATTR Type diode
SYMBOL cap 480 -896 R0
SYMATTR InstName C9
SYMATTR Value 2e-12
SYMBOL cap 560 -896 R0
SYMATTR InstName C10
SYMATTR Value 2e-12
SYMBOL LED 560 1232 R0
SYMATTR InstName D10
SYMATTR Value GREEN
SYMATTR Description Diode
SYMATTR Type diode
SYMBOL LED 480 1232 R0
SYMATTR InstName D11
SYMATTR Value GREEN
SYMATTR Description Diode
SYMATTR Type diode
SYMBOL cap 480 1136 R0
SYMATTR InstName C13
SYMATTR Value 2e-12
SYMBOL cap 560 1136 R0
SYMATTR InstName C14
SYMATTR Value 2e-12
SYMBOL LED 560 1584 R0
SYMATTR InstName D14
SYMATTR Value GREEN
SYMATTR Description Diode
SYMATTR Type diode
SYMBOL LED 480 1584 R0
SYMATTR InstName D15
SYMATTR Value GREEN
SYMATTR Description Diode
SYMATTR Type diode
SYMBOL cap 480 1488 R0
SYMATTR InstName C17
SYMATTR Value 2e-12
SYMBOL cap 560 1488 R0
SYMATTR InstName C18
SYMATTR Value 2e-12
SYMBOL res 400 688 R180
WINDOW 0 36 76 Left 0
WINDOW 3 36 40 Left 0
SYMATTR InstName R6
SYMATTR Value {rv}
SYMBOL cap 320 688 R90
WINDOW 0 0 32 VBottom 0
WINDOW 3 32 32 VTop 0
SYMATTR InstName C21
SYMATTR Value {cv}
SYMBOL ind 368 464 R0
SYMATTR InstName L5
SYMATTR Value {lv}
SYMBOL LED 560 608 R0
SYMATTR InstName D18
SYMATTR Value GREEN
SYMATTR Description Diode
SYMATTR Type diode
SYMBOL LED 480 608 R0
SYMATTR InstName D19
SYMATTR Value GREEN
SYMATTR Description Diode
SYMATTR Type diode
SYMBOL cap 480 512 R0
SYMATTR InstName C23
SYMATTR Value 2e-12
SYMBOL cap 560 512 R0
SYMATTR InstName C24
SYMATTR Value 2e-12
SYMBOL LED 560 960 R0
SYMATTR InstName D20
SYMATTR Value GREEN
SYMATTR Description Diode
SYMATTR Type diode
SYMBOL LED 480 960 R0
SYMATTR InstName D21
SYMATTR Value GREEN
SYMATTR Description Diode
SYMATTR Type diode
SYMBOL cap 480 864 R0
SYMATTR InstName C25
SYMATTR Value 2e-12
SYMBOL cap 560 864 R0
SYMATTR InstName C26
SYMATTR Value 2e-12
SYMBOL LED 560 -496 R0
SYMATTR InstName D24
SYMATTR Value GREEN
SYMATTR Description Diode
SYMATTR Type diode
SYMBOL LED 480 -496 R0
SYMATTR InstName D25
SYMATTR Value GREEN
SYMATTR Description Diode
SYMATTR Type diode
SYMBOL cap 480 -592 R0
SYMATTR InstName C32
SYMATTR Value 2e-12
SYMBOL cap 560 -592 R0
SYMATTR InstName C33
SYMATTR Value 2e-12
SYMBOL LED 560 -144 R0
SYMATTR InstName D26
SYMATTR Value GREEN
SYMATTR Description Diode
SYMATTR Type diode
SYMBOL LED 480 -144 R0
SYMATTR InstName D27
SYMATTR Value GREEN
SYMATTR Description Diode
SYMATTR Type diode
SYMBOL cap 480 -240 R0
SYMATTR InstName C34
SYMATTR Value 2e-12
SYMBOL cap 560 -240 R0
SYMATTR InstName C35
SYMATTR Value 2e-12
SYMBOL res 400 1040 R180
WINDOW 0 36 76 Left 0
WINDOW 3 36 40 Left 0
SYMATTR InstName R3
SYMATTR Value {rv}
SYMBOL cap 320 1040 R90
WINDOW 0 0 32 VBottom 0
WINDOW 3 32 32 VTop 0
SYMATTR InstName C1
SYMATTR Value {cv}
SYMBOL ind 368 816 R0
SYMATTR InstName L1
SYMATTR Value {lv}
SYMBOL res 400 1312 R180
WINDOW 0 36 76 Left 0
WINDOW 3 36 40 Left 0
SYMATTR InstName R4
SYMATTR Value {rv}
SYMBOL cap 320 1312 R90
WINDOW 0 0 32 VBottom 0
WINDOW 3 32 32 VTop 0
SYMATTR InstName C4
SYMATTR Value {cv}
SYMBOL ind 368 1088 R0
SYMATTR InstName L2
SYMATTR Value {lv}
SYMBOL res 400 1664 R180
WINDOW 0 36 76 Left 0
WINDOW 3 36 40 Left 0
SYMATTR InstName R7
SYMATTR Value {rv}
SYMBOL cap 320 1664 R90
WINDOW 0 0 32 VBottom 0
WINDOW 3 32 32 VTop 0
SYMATTR InstName C6
SYMATTR Value {cv}
SYMBOL ind 368 1440 R0
SYMATTR InstName L4
SYMATTR Value {lv}
SYMBOL res 400 208 R180
WINDOW 0 36 76 Left 0
WINDOW 3 36 40 Left 0
SYMATTR InstName R2
SYMATTR Value {rv}
SYMBOL cap 320 208 R90
WINDOW 0 0 32 VBottom 0
WINDOW 3 32 32 VTop 0
SYMATTR InstName C2
SYMATTR Value {cv}
SYMBOL ind 368 -16 R0
SYMATTR InstName L3
SYMATTR Value {lv}
SYMBOL res 400 -64 R180
WINDOW 0 36 76 Left 0
WINDOW 3 36 40 Left 0
SYMATTR InstName R8
SYMATTR Value {rv}
SYMBOL cap 320 -64 R90
WINDOW 0 0 32 VBottom 0
WINDOW 3 32 32 VTop 0
SYMATTR InstName C7
SYMATTR Value {cv}
SYMBOL ind 368 -288 R0
SYMATTR InstName L6
SYMATTR Value {lv}
SYMBOL res 400 -416 R180
WINDOW 0 36 76 Left 0
WINDOW 3 36 40 Left 0
SYMATTR InstName R9
SYMATTR Value {rv}
SYMBOL cap 320 -416 R90
WINDOW 0 0 32 VBottom 0
WINDOW 3 32 32 VTop 0
SYMATTR InstName C11
SYMATTR Value {cv}
SYMBOL ind 368 -640 R0
SYMATTR InstName L7
SYMATTR Value {lv}
SYMBOL res 400 -720 R180
WINDOW 0 36 76 Left 0
WINDOW 3 36 40 Left 0
SYMATTR InstName R10
SYMATTR Value {rv}
SYMBOL cap 320 -720 R90
WINDOW 0 0 32 VBottom 0
WINDOW 3 32 32 VTop 0
SYMATTR InstName C12
SYMATTR Value {cv}
SYMBOL ind 368 -944 R0
SYMATTR InstName L8
SYMATTR Value {lv}
SYMBOL res -288 368 R90
WINDOW 0 0 56 VBottom 0
WINDOW 3 32 56 VTop 0
SYMATTR InstName R11
SYMATTR Value {r1}
SYMBOL res -32 368 R90
WINDOW 0 0 56 VBottom 0
WINDOW 3 32 56 VTop 0
SYMATTR InstName R12
SYMATTR Value {r1}
SYMBOL res 224 368 R90
WINDOW 0 0 56 VBottom 0
WINDOW 3 32 56 VTop 0
SYMATTR InstName R13
SYMATTR Value {r1}
SYMBOL cap -32 448 R0
SYMATTR InstName C15
SYMATTR Value 2e-12
SYMBOL cap -288 448 R0
SYMATTR InstName C16
SYMATTR Value 2e-12
SYMBOL cap -544 448 R0
SYMATTR InstName C19
SYMATTR Value 1e-12
SYMBOL cap 224 448 R0
SYMATTR InstName C20
SYMATTR Value 1e-12
SYMBOL ind 0 400 R270
WINDOW 0 32 56 VTop 0
WINDOW 3 5 56 VBottom 0
SYMATTR InstName L9
SYMATTR Value {li}
SYMBOL ind -256 400 R270
WINDOW 0 32 56 VTop 0
WINDOW 3 5 56 VBottom 0
SYMATTR InstName L10
SYMATTR Value {li}
SYMBOL ind -512 400 R270
WINDOW 0 32 56 VTop 0
WINDOW 3 5 56 VBottom 0
SYMATTR InstName L11
SYMATTR Value {li}
SYMBOL cap -640 608 R0
SYMATTR InstName C22
SYMATTR Value 1e-12
TEXT 480 -1000 Left 0 !.model GREEN D(Is=25e-14 N=5 Rs=14 Eg=2.23 Tnom=27deg cjo=20e-12 bv=5 ibv=5e-6)
TEXT 856 528 Left 0 !.param lv = 0.560e-6
TEXT 856 560 Left 0 !.param rv = 0.04
TEXT 856 592 Left 0 !.param cv = 2e-12

The netlist it stands for:
* ModelAccurateColumn2.asc
Q1 vreg vpup vdecoup 0 2N2907
R1 N003 N002 {r1}
R2 N005 N004 {r1}
R3 v_n N006 {r1}
C1 N005 0 2e-12
C2 N003 0 2e-12
C3 vreg 0 1e-12
C4 v_n 0 1e-12
R4 N008 N007 {r5}
C6 N008 0 {c5}
V1 vleddrv 0 PWL(0n 0 15000n 0 15100n 5 30000n 5 30050n 0) Rser=2.5
V2 N037 0 PWL(0 5 11000n 5 11005n 0 32000n 0 32005n 5)
V3 v5v 0 5 Rser=0
L2 v_f2 N007 {li5}
L3 N005 N006 {li}
L5 N003 N004 {li}
L6 vreg N002 {li}
D5 0 vreg 1N5817
R23 vpup N035 250
V4 vleddrv2 0 PWL(0n 0 15000n 0 15100n 5 20000n 5 20050n 0) Rser=2.5
R24 N001 vreg 20
C26 0 N001 2e-8
R25 v5v N036 0.001
R26 N036 0 2000000
C9 0 N035 1e-15
R8 N035 N037 250
L7 v5v vdecoup 0.24e-6
R5 N010 N009 {r5}
C5 N010 0 {c5}
L1 N008 N009 {li5}
R6 N012 N011 {r5}
C7 N012 0 {c5}
L4 N010 N011 {li5}
R7 N014 N013 {r5}
C8 N014 0 {c5}
L8 N012 N013 {li5}
R9 N016 N015 {r5}
C10 N016 0 {c5}
L9 N014 N015 {li5}
R10 N018 N017 {r5}
C11 N018 0 {c5}
L10 N016 N017 {li5}
R11 N020 N019 {r5}
C12 N020 0 {c5}
L11 N018 N019 {li5}
R12 v_n N021 {r5}
C13 v_n 0 {c5}
L12 N020 N021 {li5}
R13 N023 N022 {r5}
C14 N023 0 {c5}
L13 v_n N022 {li5}
R14 N025 N024 {r5}
C15 N025 0 {c5}
L14 N023 N024 {li5}
R15 N027 N026 {r5}
C16 N027 0 {c5}
L15 N025 N026 {li5}
R16 N029 N028 {r5}
C17 N029 0 {c5}
L16 N027 N028 {li5}
R17 N031 N030 {r5}
C18 N031 0 {c5}
L17 N029 N030 {li5}
R18 N033 N032 {r5}
C19 N033 0 {c5}
L18 N031 N032 {li5}
R19 v_f N034 {r5}
C20 v_f 0 {c5}
L19 N033 N034 {li5}
C21 v_f2 0 {c5}
XX49 vleddrv N036 v_f2 coldrv2
XX50 vleddrv N036 v_f2 coldrv2
XX51 vleddrv N036 v_f2 coldrv2
XX52 0 N036 N008 coldrv2
XX53 0 N036 N008 coldrv2
XX54 0 N036 N008 coldrv2
XX55 vleddrv N036 N010 coldrv2
XX56 vleddrv N036 N010 coldrv2
XX57 vleddrv N036 N010 coldrv2
XX58 0 N036 N012 coldrv2
XX59 0 N036 N012 coldrv2
XX60 0 N036 N012 coldrv2
XX61 vleddrv N036 N014 coldrv2
XX62 vleddrv N036 N014 coldrv2
XX63 vleddrv N036 N014 coldrv2
XX64 0 N036 N016 coldrv2
XX65 0 N036 N016 coldrv2
XX66 0 N036 N016 coldrv2
XX67 vleddrv N036 N018 coldrv2
XX68 vleddrv N036 N018 coldrv2
XX69 vleddrv N036 N018 coldrv2
XX70 0 N036 N020 coldrv2
XX71 0 N036 N020 coldrv2
XX72 0 N036 N020 coldrv2
XX73 vleddrv2 N036 v_n coldrv2
XX74 vleddrv2 N036 v_n coldrv2
XX75 vleddrv2 N036 v_n coldrv2
XX76 0 N036 N023 coldrv2
XX77 0 N036 N023 coldrv2
XX78 0 N036 N023 coldrv2
XX79 vleddrv2 N036 N025 coldrv2
XX80 vleddrv2 N036 N025 coldrv2
XX81 vleddrv2 N036 N025 coldrv2
XX82 0 N036 N027 coldrv2
XX83 0 N036 N027 coldrv2
XX84 0 N036 N027 coldrv2
XX85 vleddrv2 N036 N029 coldrv2
XX86 vleddrv2 N036 N029 coldrv2
XX87 vleddrv2 N036 N029 coldrv2
XX88 0 N036 N031 coldrv2
XX89 0 N036 N031 coldrv2
XX90 0 N036 N031 coldrv2
XX91 vleddrv2 N036 N033 coldrv2
XX92 vleddrv2 N036 N033 coldrv2
XX93 vleddrv2 N036 N033 coldrv2
XX94 0 N036 v_f coldrv2
XX95 0 N036 v_f coldrv2
XX96 0 N036 v_f coldrv2
C22 vcap 0 100e-6
R20 vdecoup vcap .3

* block symbol definitions
.subckt coldrv2 EN Bypass Col
Q1 N016 N026 0 0 2N3391A
Q2 N026 N026 0 0 2N3391A
R1 EN N026 180
C3 v_f2 0 {cv}
D2 Col v_f2 GREEN
R5 N016 N028 {cfilr}
C5 N028 0 {cfilc}
D3 N001 v_f2 GREEN
C8 0 N001 2e-12
D6 N004 N005 GREEN
D7 N003 N005 GREEN
C9 0 N003 2e-12
C10 0 N004 2e-12
D10 N034 N035 GREEN
D11 N033 N035 GREEN
C13 0 N033 2e-12
C14 0 N034 2e-12
D14 N038 v_f GREEN
D15 N037 v_f GREEN
C17 0 N037 2e-12
C18 0 N038 2e-12
R6 N025 N022 {rv}
C21 N025 0 {cv}
L5 N015 N022 {lv}
D18 N024 N025 GREEN
D19 N023 N025 GREEN
C23 0 N023 2e-12
C24 0 N024 2e-12
D20 N030 N031 GREEN
D21 N029 N031 GREEN
C25 0 N029 2e-12
C26 0 N030 2e-12
D24 N008 N009 GREEN
D25 N007 N009 GREEN
C32 0 N007 2e-12
C33 0 N008 2e-12
D26 N012 N013 GREEN
D27 N011 N013 GREEN
C34 0 N011 2e-12
C35 0 N012 2e-12
R3 N031 N027 {rv}
C1 N031 0 {cv}
L1 N025 N027 {lv}
R4 N035 N032 {rv}
C4 N035 0 {cv}
L2 N031 N032 {lv}
R7 v_f N036 {rv}
C6 v_f 0 {cv}
L4 N035 N036 {lv}
R2 N015 N014 {rv}
C2 N015 0 {cv}
L3 N013 N014 {lv}
R8 N013 N010 {rv}
C7 N013 0 {cv}
L6 N009 N010 {lv}
R9 N009 N006 {rv}
C11 N009 0 {cv}
L7 N005 N006 {lv}
R10 N005 N002 {rv}
C12 N005 0 {cv}
L8 v_f2 N002 {lv}
R11 N018 N017 {r1}
R12 N020 N019 {r1}
R13 N015 N021 {r1}
C15 N020 0 2e-12
C16 N018 0 2e-12
C19 N016 0 1e-12
C20 N015 0 1e-12
L9 N020 N021 {li}
L10 N018 N019 {li}
L11 N016 N017 {li}
C22 0 Bypass 1e-12
.model GREEN D(Is=25e-14 N=5 Rs=14 Eg=2.23 Tnom=27deg cjo=20e-12 bv=5 ibv=5e-6)
.param lv = 0.560e-6
.param rv = 0.04
.param cv = 2e-12
.ends coldrv2

.model D D
.lib standard.dio
.model NPN NPN
.model PNP PNP
.lib standard.bjt
.tran 35000n
.param li = 0.747e-6
.param li2 = 0.1873e-6
.param ccol = 4e-12
.param ccol5 = 2e-12
.param cfilr 300
.param cfilc = 1e-9
.param li5 = 3.2478e-7
.param r5 = 0.023
.param c5 = 1e-12
.ic v(v_n) = 4.0v
.ic v(v5v) = 5.0v
.ic v(vdecoup) = 5.0v
.ic v(vcap) = 5.0v
.param r1 = 0.0532
.backanno
.end